# Altium project Bicycle_Project.PrjPcb
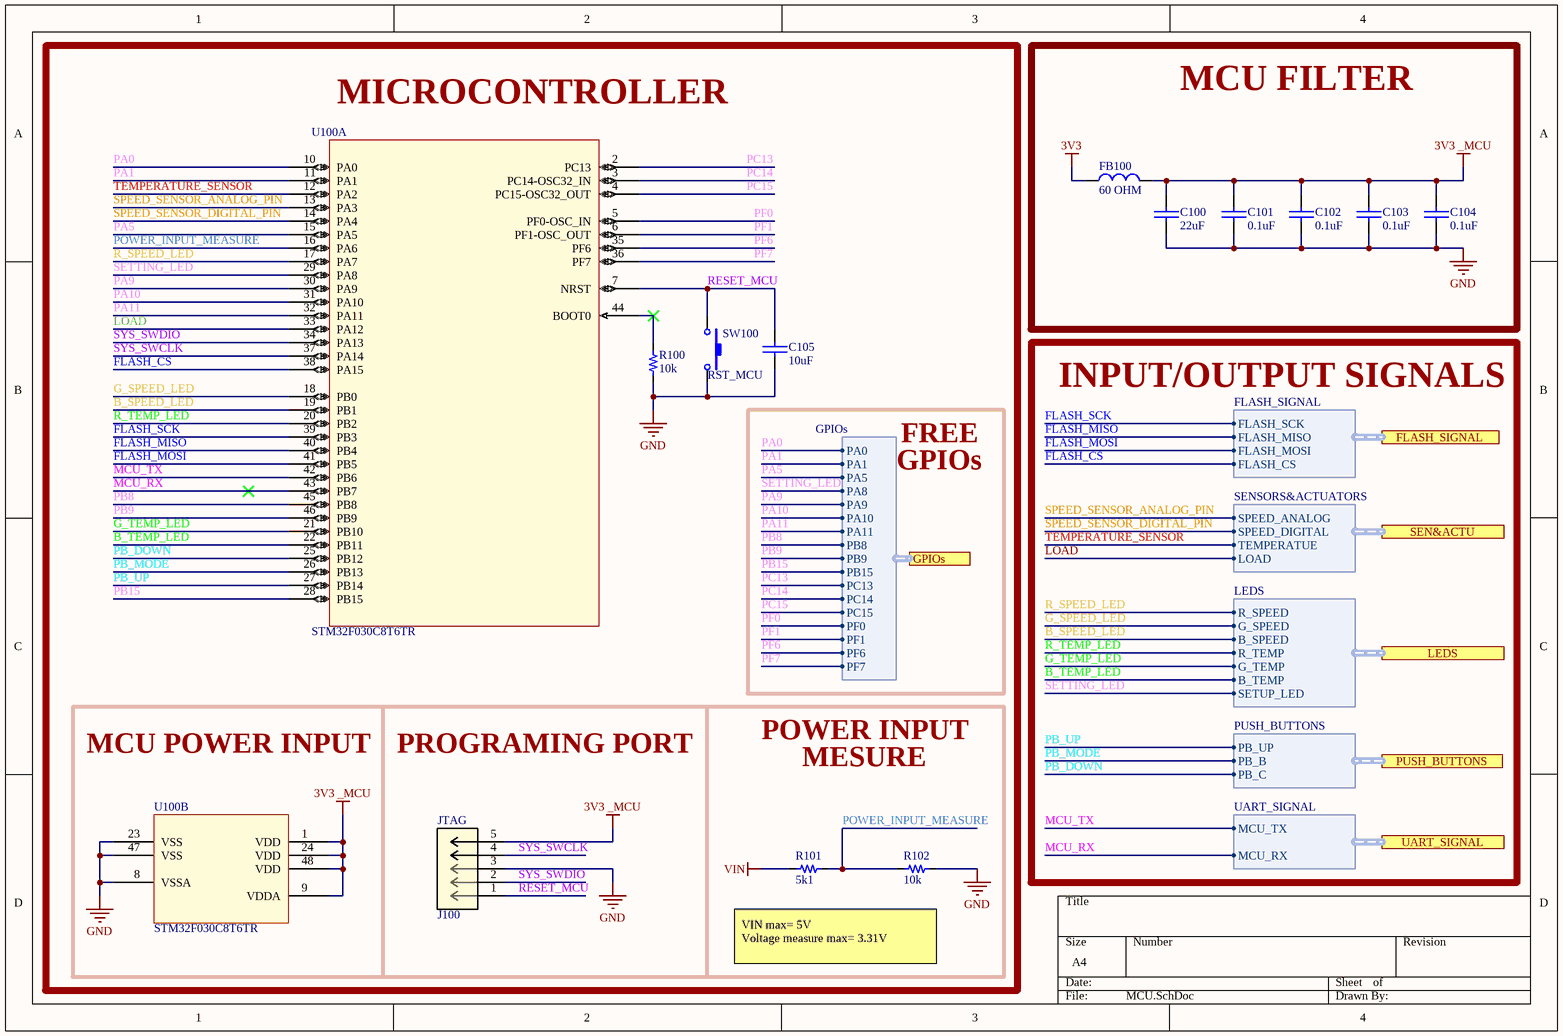
[diagram p0: MCU.SchDoc]
2 sheets, 28 parts. Net scope: hierarchical (ports join the sheet entries above them; power ports are global).
Board file: Bicycle_Project.PcbDoc
Sheets:
  MCU.SchDoc
  Power.SchDoc

## Sheet MCU.SchDoc
size A4; SheetNumber: 2; SheetTotal: 5

### Parts
C100  value 22uF  [0603_cap]  (hidden comment: 22uF 6V3)
C101  value 0.1uF  [0603_cap]  (hidden comment: 0.1uF 50V)
C102  value 0.1uF  [0603_cap]  (hidden comment: 0.1uF 50V)
C103  value 0.1uF  [0603_cap]  (hidden comment: 0.1uF 50V)
C104  value 0.1uF  [0603_cap]  (hidden comment: 0.1uF 50V)
C105  value 10uF  [0603_cap]  (hidden comment: 10uF 10V)
FB100  value 60 OHM  [0603_fb]  (hidden comment: 60OHM 2A)
J100  JTAG  [CON_5X1_TH_2.54MM]
R100  value 10k  [0603_res]  (hidden comment: 10k 1/10W)
R101  value 5k1  [0603_res]  (hidden comment: 5k1 1/10W)
R102  value 10k  [0603_res]  (hidden comment: 10k 1/10W)
SW100  RST_MCU  [Sw_PUSH_4.5x4.5x5mm]
U100  STM32F030C8T6TR  [LQFP48_7x7mm]  (parts A,B of 2)

### Blocks framed on the sheet
MICROCONTROLLER: C105 J100 R100-R102 SW100 U100
MCU FILTER: C100-C104 FB100

### Ports
FLASH_SIGNAL (harness FLASH_SIGNAL, see main[2B], Communication[4D]), GPIOs (harness GPIOs, see main[2C], Power[3C]), LEDS (harness LEDS, see main[2C], INPUTS_OUTPUTS[4B]), PUSH_BUTTONS (harness PUSH_BUTTONS, see main[2C], INPUTS_OUTPUTS[4B]), SEN&ACTU (harness SENSORS&ACTUATORS, see main[2C], INPUTS_OUTPUTS[4A]), UART_SIGNAL (harness UART_SIGNAL, see main[2B], Communication[4C])

### Harnesses
LEDS: R_SPEED, G_SPEED, B_SPEED, R_TEMP, G_TEMP, B_TEMP, SETUP_LED
SENSORS&ACTUATORS: SPEED_ANALOG, SPEED_DIGITAL, TEMPERATUE, LOAD
PUSH_BUTTONS: PB_UP, PB_B, PB_C
FLASH_SIGNAL: FLASH_SCK, FLASH_MISO, FLASH_MOSI, FLASH_CS
UART_SIGNAL: MCU_TX, MCU_RX
GPIOs: PA0, PA1, PA5, PA8, PA9, PA10, PA11, PB8, PB9, PB15, PC13, PC14, PC15, PF0, PF1, PF6, PF7

### Nets
3V3: FB100.2
3V3 _MCU: C100.1 C101.1 C102.1 C103.1 C104.1 FB100.1 J100.5 U100.1(VDD) U100.9(VDDA) U100.24(VDD) U100.48(VDD)
GND: C100.2 C101.2 C102.2 C103.2 C104.2 C105.2 J100.3 R100.2 R102.1 SW100.2 U100.8(VSSA) U100.23(VSS) U100.47(VSS)
VIN: R101.2
B_SPEED_LED: U100.19(PB1) ; port LEDS.B_SPEED
B_TEMP_LED: U100.22(PB11) ; port LEDS.B_TEMP
FLASH_CS: U100.38(PA15) ; port FLASH_SIGNAL.FLASH_CS
FLASH_MISO: U100.40(PB4) ; port FLASH_SIGNAL.FLASH_MISO
FLASH_MOSI: U100.41(PB5) ; port FLASH_SIGNAL.FLASH_MOSI
FLASH_SCK: U100.39(PB3) ; port FLASH_SIGNAL.FLASH_SCK
G_SPEED_LED: U100.18(PB0) ; port LEDS.G_SPEED
G_TEMP_LED: U100.21(PB10) ; port LEDS.G_TEMP
LOAD: U100.33(PA12) ; port SEN&ACTU.LOAD
MCU_RX: U100.43(PB7) ; port UART_SIGNAL.MCU_RX
MCU_TX: U100.42(PB6) ; port UART_SIGNAL.MCU_TX
PA0: U100.10(PA0) ; port GPIOs.PA0
PA1: U100.11(PA1) ; port GPIOs.PA1
PA5: U100.15(PA5) ; port GPIOs.PA5
PA9: U100.30(PA9) ; port GPIOs.PA9
PA10: U100.31(PA10) ; port GPIOs.PA10
PA11: U100.32(PA11) ; port GPIOs.PA11
PB8: U100.45(PB8) ; port GPIOs.PB8
PB9: U100.46(PB9) ; port GPIOs.PB9
PB15: U100.28(PB15) ; port GPIOs.PB15
PB_DOWN: U100.25(PB12) ; port PUSH_BUTTONS.PB_C
PB_MODE: U100.26(PB13) ; port PUSH_BUTTONS.PB_B
PB_UP: U100.27(PB14) ; port PUSH_BUTTONS.PB_UP
PC13: U100.2(PC13) ; port GPIOs.PC13
PC14: U100.3(PC14-OSC32_IN) ; port GPIOs.PC14
PC15: U100.4(PC15-OSC32_OUT) ; port GPIOs.PC15
PF0: U100.5(PF0-OSC_IN) ; port GPIOs.PF0
PF1: U100.6(PF1-OSC_OUT) ; port GPIOs.PF1
PF6: U100.35(PF6) ; port GPIOs.PF6
PF7: U100.36(PF7) ; port GPIOs.PF7
POWER_INPUT_MEASURE: R101.1 R102.2 U100.16(PA6)
R_SPEED_LED: U100.17(PA7) ; port LEDS.R_SPEED
R_TEMP_LED: U100.20(PB2) ; port LEDS.R_TEMP
RESET_MCU: C105.1 J100.1 SW100.1 U100.7(NRST)
SETTING_LED: U100.29(PA8) ; port LEDS.SETUP_LED, port GPIOs.PA8
SPEED_SENSOR_ANALOG_PIN: U100.13(PA3) ; port SEN&ACTU.SPEED_ANALOG
SPEED_SENSOR_DIGITAL_PIN: U100.14(PA4) ; port SEN&ACTU.SPEED_DIGITAL
SYS_SWCLK: J100.4 U100.37(PA14)
SYS_SWDIO: J100.2 U100.34(PA13)
TEMPERATURE_SENSOR: U100.12(PA2) ; port SEN&ACTU.TEMPERATUE
NetR100_1: R100.1 U100.44(BOOT0)

### Notes on the sheet
- FREE
- INPUT/OUTPUT SIGNALS
- GPIOs
- MCU POWER INPUT
- PROGRAMING PORT
- POWER INPUT
- MESURE
- VIN max= 5V
  Voltage measure max= 3.31V

### Library data of the parts
C100 = Cap_22uF_0805_6V3: 6.3V 22uF X5R ±20% 0805 Multilayer Ceramic Capacitors MLCC - SMD/SMT ROHS; Manufacturer: Samsung Electro-Mechanics; Manufacturer Part Number: CL21A226MQQNNNE; Supplier 1: LCSC; Supplier Part Number 1: C5674; ComponentLink1Description: LCSC; ComponentLink1URL: https://www.lcsc.com/product-detail/Multilayer-Ceramic-Capacitors-MLCC-SMD-SMT_Samsung-Electro-Mechanics-CL21A226MQQNNNE_C5674.html
C101-C104 = Cap_0.1uF_0603_50V: 50V 100nF Y5V -20%~+80% 0603 Multilayer Ceramic Capacitors MLCC - SMD/SMT ROHS; Manufacturer: Walsin Tech Corp; Manufacturer Part Number: 0603F104Z500CT; Supplier 1: LCSC; Supplier Part Number 1: C83060; ComponentLink1Description: LCSC; ComponentLink1URL: https://www.lcsc.com/product-detail/Multilayer-Ceramic-Capacitors-MLCC-SMD-SMT_Walsin-Tech-Corp-0603F104Z500CT_C83060.html
C105 = Cap_10uF_0603_10V: 10V 10uF X5R ±10% 0603 Multilayer Ceramic Capacitors MLCC - SMD/SMT ROHS; Manufacturer: CCTC; Manufacturer Part Number: TCC0603X5R106K100CT; Supplier 1: LCSC; Supplier Part Number 1: C380314; ComponentLink1Description: LCSC; ComponentLink1URL: https://www.lcsc.com/product-detail/Multilayer-Ceramic-Capacitors-MLCC-SMD-SMT_CCTC-TCC0603X5R106K100CT_C380314.html
FB100 = FB_60_0603_2A: 2A 1 100mΩ 60Ω@100MHz ±25% 0603 Ferrite Beads ROHS; Manufacturer: TAI-TECH; Manufacturer Part Number: HCB1608KF-600T20; ComponentLink1Description: LCSC; ComponentLink1URL: https://www.lcsc.com/product-detail/Ferrite-Beads_TAI-TECH-HCB1608KF-600T20_C369516.html; Supplier 1: LCSC; Supplier Part Number 1: C369516
J100 = Con_5X1_TH_2.54mm: CONN HEADER VERT 5POS 2.54MM; Manufacturer: Amphenol ICC (FCI); Manufacturer Part Number: 10129378-905001BLF; Supplier 1: Digi-Key; Supplier Part Number 1: 10129378-905001BLF-ND; Value: *; ComponentLink1Description: Digi-Key; ComponentLink1URL: https://www.digikey.com/en/products/detail/amphenol-cs-fci/10129378-905001BLF/7915937?s=N4IgTCBcDaIIwAY5gJwGYDsAOAtChArAkgEIAyAYiALoC%2BQA
R100 R102 = Res_10k_0603_1/10W: RES SMD 10k OHM 5% 1/10W 0603; Manufacturer: FOJAN; Manufacturer Part Number: FRC0603J103TS; ComponentLink1URL: https://www.lcsc.com/product-detail/Chip-Resistor-Surface-Mount_FOJAN-FRC0603J103TS_C2930027.html; Supplier 1: LCSC; Supplier Part Number 1: C2930027; ComponentLink1Description: LCSC
R101 = Res_5k1_0603_1/10W: RES SMD 5k1 OHM 5% 1/10W 0603; Manufacturer: FOJAN; Manufacturer Part Number: FRC0603J512 TS; ComponentLink1URL: https://www.lcsc.com/product-detail/Chip-Resistor-Surface-Mount_FOJAN-FRC0603J512-TS_C2907114.html; Supplier 1: LCSC; Supplier Part Number 1: C2907114; ComponentLink1Description: LCSC
SW100 = Sw_PUSH_4.5x4.5x5.0xmm: SWITCH TACTILE SPST-NO 0.05A 12V; Manufacturer: BZCN; Manufacturer Part Number: TSC015A05026A; Supplier 1: LCSC; Supplier Part Number 1: C2888509; Last modified by: N-A.Potosi; Last modified date: 20190222; ComponentLink1Description: LCSC; ComponentLink1URL: https://www.lcsc.com/product-detail/Tactile-Switches_BZCN-TSC015A05026A_C2888509.html
U100 = IC_STM32F030C8T6TR_LQFP48_7x7MM: IC MCU 32BIT 64KB FLASH 48LQFP; Manufacturer: STMicroelectronics; Manufacturer part number: STM32F030C8T6TR; Supplier 1: LCSC; Supplier Part Number 1: C23922; ComponentLink1Description: LCSC; ComponentLink1URL: https://www.lcsc.com/product-detail/ST-Microelectronics_STMicroelectronics-STM32F030C8T6_C23922.html

## Sheet Power.SchDoc
size A4; SheetNumber: 3; SheetTotal: 5
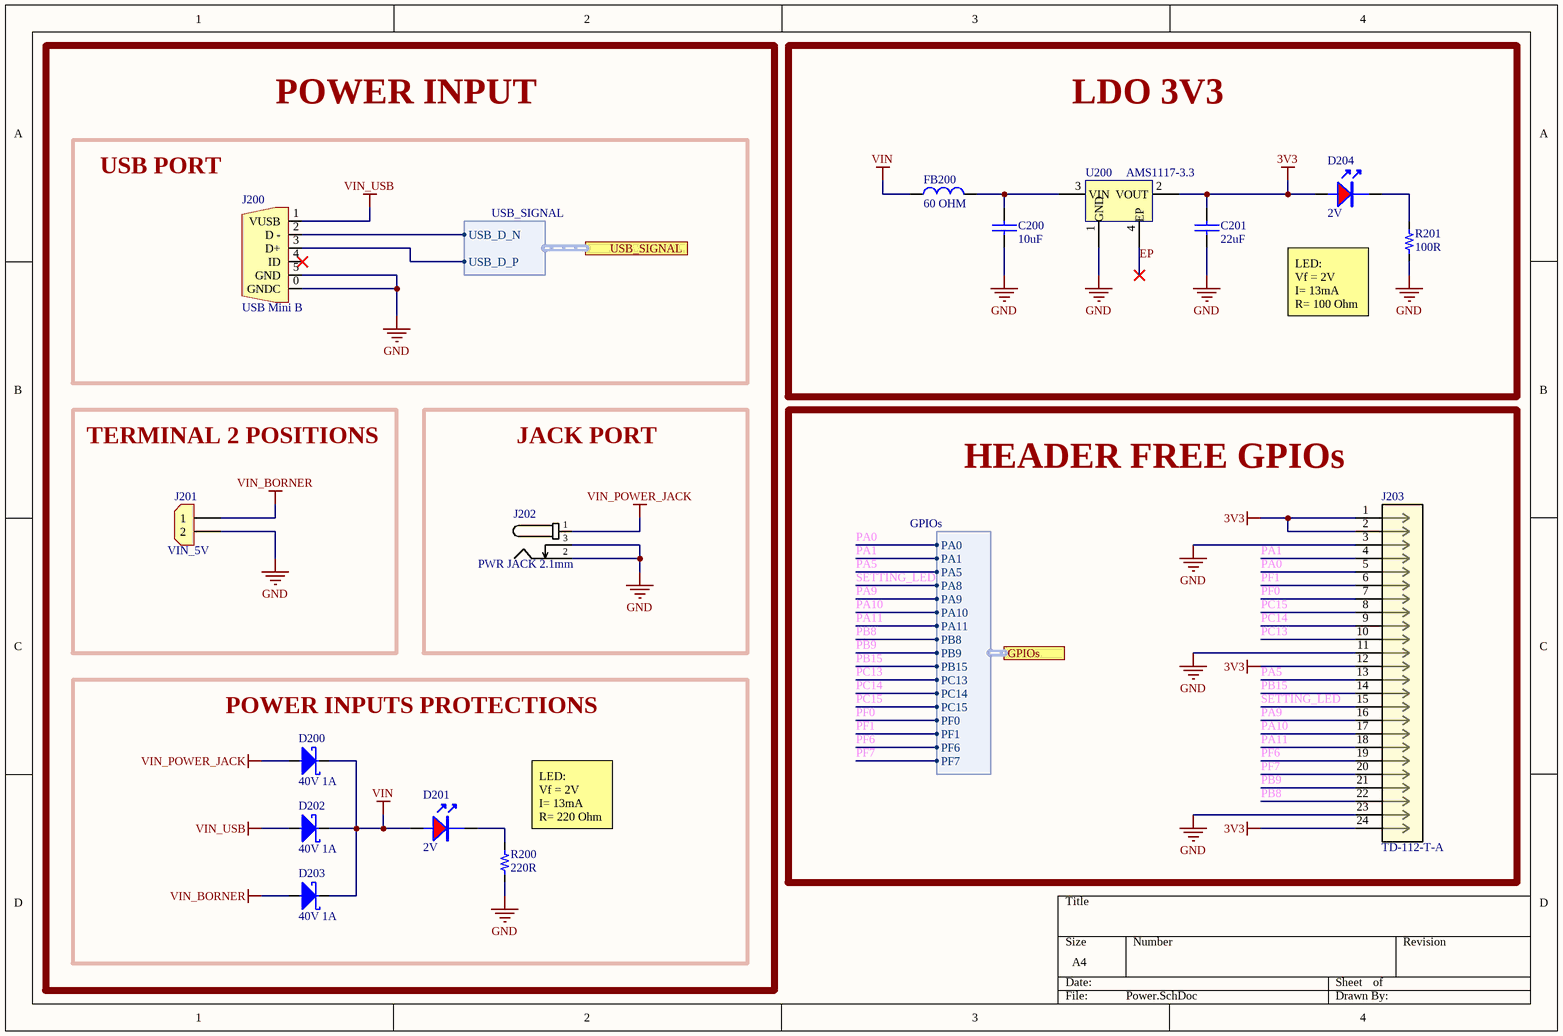
[diagram p1: Power.SchDoc]

### Parts
C200  value 10uF  [0603_cap]  (hidden comment: 10uF 10V)
C201  value 22uF  [0603_cap]  (hidden comment: 22uF 6V3)
D200  40V 1A  [SOD_123]
D201  2V  [0805_LED]
D202  40V 1A  [SOD_123]
D203  40V 1A  [SOD_123]
D204  2V  [0805_LED]
FB200  value 60 OHM  [0603_fb]  (hidden comment: 60OHM 2A)
J200  USB Mini B  [CON_5x1_SMD_miniUSB_B]
J201  VIN_5V  [CON_2x1_TH_5MM]
J202  PWR JACK 2.1mm  [CON_POWER_BARREL_2.1MM_3CONN]
J203  TD-112-T-A  [CON_12X2_TH_2.54mm]
R200  value 220R  [0603_res]  (hidden comment: 220R 1/10W)
R201  value 100R  [0603_res]  (hidden comment: 100R 1/10W)
U200  AMS1117-3.3  [SOT_223]

### Blocks framed on the sheet
LDO 3V3: C200 C201 D204 FB200 R201 U200
USB PORT: J200
TERMINAL 2 POSITIONS: J201
JACK PORT: J202
HEADER FREE GPIOs: J203
POWER INPUTS PROTECTIONS: D200-D203 R200

### Ports
GPIOs (harness GPIOs, see main[3B], MCU[3C]), USB_SIGNAL (harness USB_SIGNAL, see main[3B], Communication[1B])

### Harnesses
USB_SIGNAL: USB_D_N, USB_D_P
GPIOs: PA0, PA1, PA5, PA8, PA9, PA10, PA11, PB8, PB9, PB15, PC13, PC14, PC15, PF0, PF1, PF6, PF7

### Nets
3V3: C201.1 D204.1(A) J203.1 J203.2 J203.12 J203.24 U200.2(VOUT)
GND: C200.2 C201.2 J200.0(GNDC) J200.5(GND) J201.2 J202.2 J202.3 J203.3 J203.11 J203.23 R200.1 R201.1 U200.1(GND)
VIN: D200.1 D201.1(A) D202.1 D203.1 FB200.1
VIN_BORNER: D203.2 J201.1
VIN_POWER_JACK: D200.2 J202.1
VIN_USB: D202.2 J200.1(VUSB)
EP: U200.4(EP)
PA0: J203.5 ; port GPIOs.PA0
PA1: J203.4 ; port GPIOs.PA1
PA5: J203.13 ; port GPIOs.PA5
PA9: J203.16 ; port GPIOs.PA9
PA10: J203.17 ; port GPIOs.PA10
PA11: J203.18 ; port GPIOs.PA11
PB8: J203.22 ; port GPIOs.PB8
PB9: J203.21 ; port GPIOs.PB9
PB15: J203.14 ; port GPIOs.PB15
PC13: J203.10 ; port GPIOs.PC13
PC14: J203.9 ; port GPIOs.PC14
PC15: J203.8 ; port GPIOs.PC15
PF0: J203.7 ; port GPIOs.PF0
PF1: J203.6 ; port GPIOs.PF1
PF6: J203.19 ; port GPIOs.PF6
PF7: J203.20 ; port GPIOs.PF7
SETTING_LED: J203.15 ; port GPIOs.PA8
NetC200_1: C200.1 FB200.2 U200.3(VIN)
NetD201_2: D201.2 R200.2
NetD204_2: D204.2 R201.2
NetJ200_2: J200.2(D_-) ; port USB_SIGNAL.USB_D_N
NetJ200_3: J200.3(D+) ; port USB_SIGNAL.USB_D_P

Not connected (* = marked no-connect by the designer): J200 4(ID)*

### Notes on the sheet
- POWER INPUT
- LED:
  Vf = 2V
  I= 13mA
  R= 100 Ohm
- (near R200) LED:
  Vf = 2V
  I= 13mA
  R= 220 Ohm

### Library data of the parts
C200 = Cap_10uF_0603_10V: as C105 on sheet MCU; Supplier 1: LCSC; Supplier Part Number 1: C380314; ComponentLink1Description: LCSC; ComponentLink1URL: https://www.lcsc.com/product-detail/Multilayer-Ceramic-Capacitors-MLCC-SMD-SMT_CCTC-TCC0603X5R106K100CT_C380314.html
C201 = Cap_22uF_0805_6V3: as C100 on sheet MCU; Supplier 1: LCSC; Supplier Part Number 1: C5674; ComponentLink1Description: LCSC; ComponentLink1URL: https://www.lcsc.com/product-detail/Multilayer-Ceramic-Capacitors-MLCC-SMD-SMT_Samsung-Electro-Mechanics-CL21A226MQQNNNE_C5674.html
D200 D202 D203 = D_Schottky_40V_1A_SOD_123F: DIODE SCHOTTKY 40V 1A SOD123F; Manufacturer: Shanghai Prisemi Elec; Manufacturer Part Number: PSBD1DF40V1H; Supplier 1: LCSC; Supplier Part Number 1: C110730; ComponentLink1Description: LCSC; ComponentLink1URL: https://www.lcsc.com/product-detail/Switching-Diode_Shanghai-Prisemi-Elec-PSBD1DF40V1H_C110730.html
D201 D204 = LED_0805_RED: LED RED CLEAR 0805 SMD; Manufacturer: XINGLIGHT; Manufacturer Part Number: XL-2012SURC; Supplier 1: LCSC; Supplier Part Number 1: C965812; ComponentLink1Description: LCSC; ComponentLink1URL: https://www.lcsc.com/product-detail/Light-Emitting-Diodes-LED_XINGLIGHT-XL-2012SURC_C965812.html
FB200 = FB_60_0603_2A: as FB100 on sheet MCU; ComponentLink1Description: LCSC; ComponentLink1URL: https://www.lcsc.com/product-detail/Ferrite-Beads_TAI-TECH-HCB1608KF-600T20_C369516.html; Supplier 1: LCSC; Supplier Part Number 1: C369516
J200 = Con_Mini_USB_B: CONN RCPT USB2.0 MINI B SMD R/A; Manufacturer Part Number: KH-MINI-SMT-5P-Cu; Manufacturer: EDAC Inc.; ComponentLink1Description: LCSC; ComponentLink1URL: https://datasheet.lcsc.com/lcsc/2106070035_Shenzhen-Kinghelm-Elec-KH-MINI-SMT-5P-Cu_C2688795.pdf; Supplier 1: LCSC; Supplier Part Number 1: C2688795
J201 = Con_2x1_TH_5mm: 2POS 5MM; Manufacturer: JILN; Manufacturer Part Number: JL126-50002G01; Supplier 1: LCSC; Supplier Part Number 1: C394556; ComponentLink1Description: Digi-Key; ComponentLink1URL: https://www.lcsc.com/product-detail/Screw-terminal_JILN-JL126-50002G01_C394556.html
J202 = Con_Power_Jack_2.1mm_3pins: CONN PWR JACK 2X5.5MM SOLDER; Manufacturer: HCTL; Manufacturer Part Number: HC-DC-005-2.0T; Supplier 1: LCSC; Supplier Part Number 1: C3010533; ComponentLink1Description: LCSC; ComponentLink1URL: https://www.lcsc.com/product-detail/AC-DC-Power-Connectors_HCTL-HC-DC-005-2-0T_C3010533.html
J203 = Con_12X2_TH_2.54mm: CONN HEADER VERT 24POS 2.54MM; Manufacturer: Samtec Inc.; Manufacturer Part Number: TD-112-T-A; Supplier 1: DigiKey; Supplier Part Number 1: SAM1114-12-ND; ComponentLink1Description: Digi-Key; ComponentLink1URL: https://www.digikey.com/en/products/detail/samtec-inc/TD-112-T-A/1105546
R200 = Res_220R_0603_1/10W: RES SMD 220R OHM 5% 1/10W 0603; Manufacturer: FOJAN; Manufacturer Part Number: FRC0603J221 TS; ComponentLink1URL: https://www.lcsc.com/product-detail/Chip-Resistor-Surface-Mount_FOJAN-FRC0603J221-TS_C2907127.html; Supplier 1: LCSC; Supplier Part Number 1: C2907127; ComponentLink1Description: LCSC
R201 = Res_100R_0603_1/10W: RES SMD 100R OHM 5% 1/10W 0603; Manufacturer: FOJAN; Manufacturer Part Number: FRC0603J101 TS; ComponentLink1URL: https://www.lcsc.com/product-detail/Chip-Resistor-Surface-Mount_FOJAN-FRC0603J101-TS_C2907089.html; Supplier 1: LCSC; Supplier Part Number 1: C2907089; ComponentLink1Description: LCSC
U200 = LDO_3V3_1A_FIXED: 1A 60dB@(120Hz) Fixed 3.3V Positive 18V SOT-223 Linear Voltage Regulators (LDO) ROHS; Manufacturer: UMW(Youtai Semiconductor Co., Ltd.); ComponentLink1Description: LCSC; ComponentLink1URL: https://www.lcsc.com/product-detail/_UMW-Youtai-Semiconductor-Co-Ltd-_C347222.html; Supplier 1: LCSC; Manufacturer Part Number: AMS1117-3.3; Supplier Part Number 1: C347222

## Nets that join several sheets
3V3: MCU (FB100.2), Power (7 pins)
GND: MCU (13 pins), Power (13 pins)
VIN: MCU (R101.2), Power (5 pins)